# EAGLE design Shield_Eth06-REV3 (EAGLE 6.4)
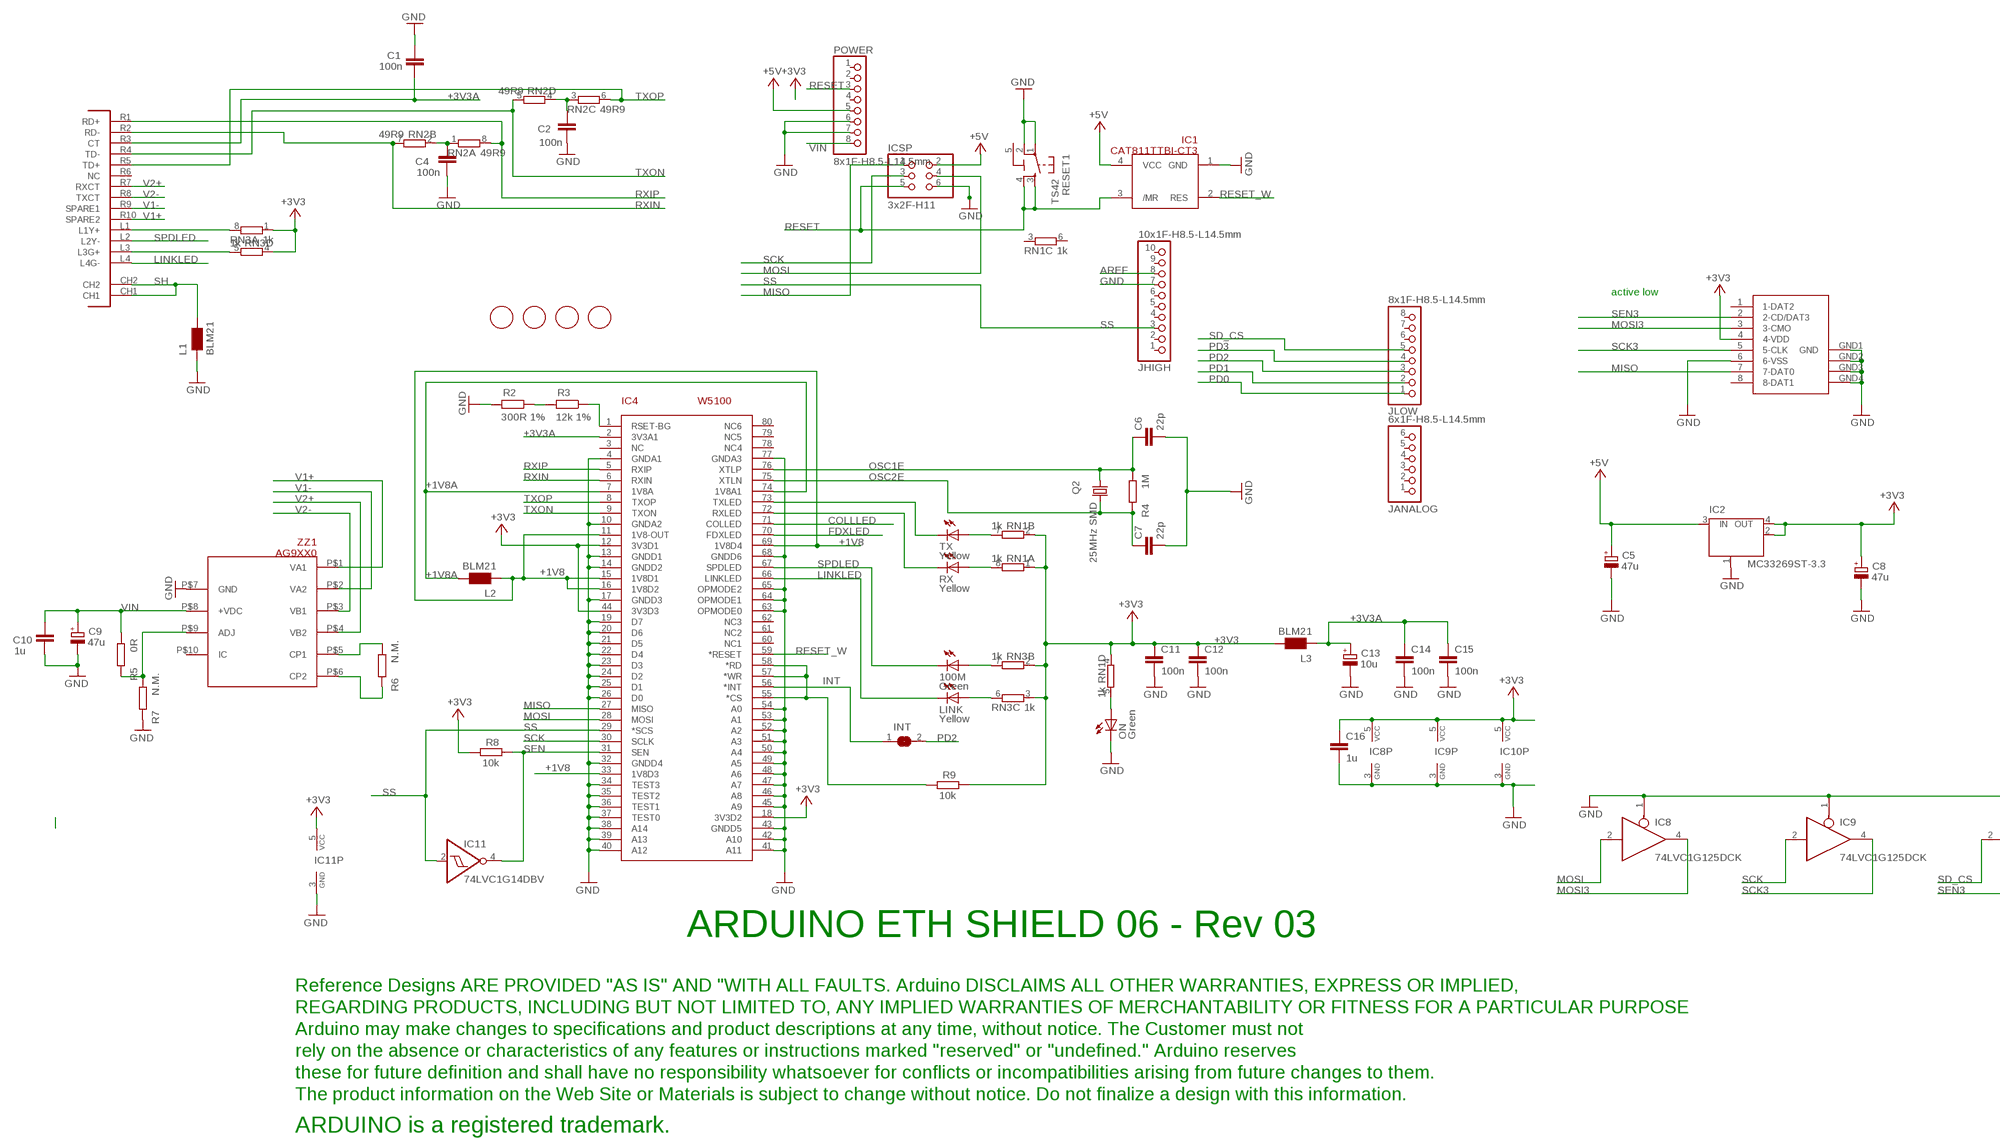
[diagram p0: schematic, sheet 1, part 1 of 2]
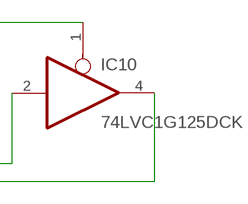
[diagram p1: schematic, sheet 1, part 2 of 2]

## Parts
100M  Green  LEDCHIPLED_0805  [CHIPLED_0805]
C1  100n  C-EUC0603  [C0603-ROUND]
C2  100n  C-EUC0603  [C0603-ROUND]
C4  100n  C-EUC0603  [C0603-ROUND]
C5  47u  CPOL-EUD  [PANASONIC_D]
C6  22p  C-EUC0603  [C0603-ROUND]
C7  22p  C-EUC0603  [C0603-ROUND]
C8  47u  CPOL-EUD  [PANASONIC_D]
C9  47u  CPOL-EUD  [PANASONIC_D]
C10  1u  C-EUC0603  [C0603-ROUND]
C11  100n  C-EUC0603  [C0603-ROUND]
C12  100n  C-EUC0603  [C0603-ROUND]
C13  10u  CPOL-EUSMCB  [SMC_B]
C14  100n  C-EUC0603  [C0603-ROUND]
C15  100n  C-EUC0603  [C0603-ROUND]
C16  1u  C-EUC0603  [C0603-ROUND]
FID1  FIDUCIALMOUNT  [FIDUCIA-MOUNT]
FID2  FIDUCIALMOUNT  [FIDUCIA-MOUNT]
FID3  FIDUCIALMOUNT  [FIDUCIA-MOUNT]
FID4  FIDUCIALMOUNT  [FIDUCIA-MOUNT]
IC1  CAT811TTBI-CT3  STM812  [SOT143]
IC2  MC33269ST-3.3  MC33269ST-3.3T3  [SOT223]
IC4  W5100  [SQFP-S-10X10-80]
IC8  74LVC1G125DCK  [SC70-5]
IC9  74LVC1G125DCK  [SC70-5]
IC10  74LVC1G125DCK  [SC70-5]
IC11  74LVC1G14DBV  [SOT23-5]
ICSP  3x2F-H11  PINHD-2X3  [2X03]
INT  SJ  [SJ]
JANALOG  6x1F-H8.5-L14.5mm  PINHD-1X6  [1X06]
JHIGH  10x1F-H8.5-L14.5mm  PINHD-1X10  [1X10]
JLOW  8x1F-H8.5-L14.5mm  PINHD-1X8  [1X08]
L1  BLM21  WE-CBF_0805  [0805]
L2  BLM21  WE-CBF_0805  [0805]
L3  BLM21  WE-CBF_0805  [0805]
LINK  Yellow  LEDCHIPLED_0805  [CHIPLED_0805]
ON  Green  LEDCHIPLED_0805  [CHIPLED_0805]
POWER  8x1F-H8.5-L14.5mm  PINHD-1X8  [1X08]
Q2  25MHz SMD  CRYSTALHC49UP  [HC49UP]
R2  300R 1%  R-EU_0603-RND  [R0603-ROUND]
R3  12k 1%  R-EU_0603-RND  [R0603-ROUND]
R4  1M  R-EU_0603-RND  [R0603-ROUND]
R5  0R  R-EU_0603-RND  [R0603-ROUND]
R6  N.M.  R-EU_0603-RND  [R0603-ROUND]
R7  N.M.  R-EU_0603-RND  [R0603-ROUND]
R8  10k  R-EU_0603-RND  [R0603-ROUND]
R9  10k  R-EU_R0603  [R0603-ROUND]
RESET1  TS42  [TS42]
RN1  1k  4R-NCAY16  [CAY16]
RN2  49R9  4R-NCAY16  [CAY16]
RN3  1k  4R-NCAY16  [CAY16]
RX  Yellow  LEDCHIPLED_0805  [CHIPLED_0805]
TX  Yellow  LEDCHIPLED_0805  [CHIPLED_0805]
U$1  POE-RJ45  [POE-RJ45]
U$2  DISCLAIMER  [DISCLAIMER]
X1  SDCARD-15TW-8821  [SDCARD-15TW-8821]
ZZ1  AG9XX0  [AG9000]

## Nets
+1V8 [power]: IC4.11(1V8-OUT) IC4.15(1V8D1) IC4.16(1V8D2) IC4.33(1V8D3) IC4.69(1V8D4) L2.1
+1V8A [power]: IC4.7(1V8A) IC4.74(1V8A1) L2.2
+3V3 [power]: C8.+ C11.1 C12.1 C16.1 IC2.2(OUT) IC2.4(OUT) IC4.12(3V3D1) IC4.18(3V3D2) IC4.44(3V3D3) IC8.5(VCC) IC9.5(VCC) IC10.5(VCC) IC11.5(VCC) L3.2 R8.1 R9.2 RN1.1 RN1.2 RN1.4 RN3.1 RN3.2 RN3.3 RN3.4 X1.4(4-VDD)
+3V3A [power]: C1.1 C13.+ C14.1 C15.1 IC4.2(3V3A1) L3.1 U$1.R3(CT)
+5V [power]: C5.+ IC1.4(VCC) IC2.3(IN) ICSP.2 POWER.5
AREF: JHIGH.8
COLLLED: IC4.71(COLLED)
FDXLED: IC4.70(FDXLED)
GND [power]: C1.2 C2.1 C4.1 C5.- C6.2 C7.2 C8.- C9.- C10.1 C11.2 C12.2 C13.- C14.2 C15.2 C16.2 IC1.1(GND) IC2.1(GND/ADJ) IC4.4(GNDA1) IC4.10(GNDA2) IC4.13(GNDD1) IC4.14(GNDD2) IC4.17(GNDD3) IC4.19(D7) IC4.20(D6) IC4.21(D5) IC4.22(D4) IC4.23(D3) IC4.24(D2) IC4.25(D1) IC4.26(D0) IC4.32(GNDD4) IC4.34(TEST3) IC4.35(TEST2) IC4.36(TEST1) IC4.37(TEST0) IC4.38(A14) IC4.39(A13) IC4.40(A12) IC4.41(A11) IC4.42(A10) IC4.43(GNDD5) IC4.45(A9) IC4.46(A8) IC4.47(A7) IC4.48(A6) IC4.49(A5) IC4.50(A4) IC4.51(A3) IC4.52(A2) IC4.53(A1) IC4.54(A0) IC4.63(OPMODE0) IC4.64(OPMODE1) IC4.65(OPMODE2) IC4.68(GNDD6) IC4.77(GNDA3) IC8.1(OE) IC8.3(GND) IC9.1(OE) IC9.3(GND) IC10.1(OE) IC10.3(GND) IC11.3(GND) ICSP.6 JHIGH.7 L1.1 ON.C POWER.6 POWER.7 R2.2 R7.2 RESET1.1 RESET1.2 X1.6(6-VSS) X1.GND1(GND) X1.GND2(GND1) X1.GND3(GND2) X1.GND4(GND3) ZZ1.P$7(GND)
INT: IC4.56(*INT) INT.1
LINKLED: IC4.66(LINKLED) LINK.C U$1.L4(L4G-)
MISO: IC4.27(MISO) ICSP.1 X1.7(7-DAT0)
MOSI: IC4.28(MOSI) IC8.2(I) ICSP.4
MOSI3: IC8.4(O) X1.3(3-CMO)
N$2: RN3.5 U$1.L3(L3G+)
N$3: RN3.8 U$1.L1(L1Y+)
N$6: IC4.73(TXLED) TX.C
N$7: IC4.72(RXLED) RX.C
N$8: ON.A RN1.5
N$9: RN1.7 TX.A
N$10: C2.2 RN2.3 RN2.4
N$22: RN1.8 RX.A
N$25: 100M.A RN3.7
N$26: LINK.A RN3.6
N$29: C4.2 RN2.1 RN2.2
N$30: R2.1 R3.2
N$31: IC4.1(RSET-BG) R3.1
N$32: R6.1 ZZ1.P$5(CP1)
N$33: R6.2 ZZ1.P$6(CP2)
N$34: R5.2 R7.1 ZZ1.P$9(ADJ)
N$36: IC4.55(*CS) IC4.57(*WR) IC4.58(*RD) R9.1
OSC1E: C6.1 IC4.76(XTLP) Q2.1 R4.1
OSC2E: C7.1 IC4.75(XTLN) Q2.2 R4.2
PD0: JLOW.1
PD1: JLOW.2
PD2: INT.2 JLOW.3
PD3: JLOW.4
RESET: IC1.3(/MR) ICSP.5 POWER.3 RESET1.3 RESET1.4
RESET_W: IC1.2(RES) IC4.59(*RESET)
RXIN: IC4.6(RXIN) RN2.7 U$1.R2(RD-)
RXIP: IC4.5(RXIP) RN2.8 U$1.R1(RD+)
SCK: IC4.30(SCLK) IC9.2(I) ICSP.3
SCK3: IC9.4(O) X1.5(5-CLK)
SD_CS: IC10.2(I) JLOW.5
SEN: IC4.31(SEN) IC11.4(O) R8.2
SEN3: IC10.4(O) X1.2(2-CD/DAT3)
SH: L1.2 U$1.CH1 U$1.CH2
SPDLED: 100M.C IC4.67(SPDLED) U$1.L2(L2Y-)
SS: IC4.29(*SCS) IC11.2(I) JHIGH.3
TXON: IC4.9(TXON) RN2.5 U$1.R4(TD-)
TXOP: IC4.8(TXOP) RN2.6 U$1.R5(TD+)
V1+ [VIN]: U$1.R10(SPARE2) ZZ1.P$1(VA1)
V1- [VIN]: U$1.R9(SPARE1) ZZ1.P$2(VA2)
V2+ [VIN]: U$1.R7(RXCT) ZZ1.P$4(VB2)
V2- [VIN]: U$1.R8(TXCT) ZZ1.P$3(VB1)
VIN [VIN]: C9.+ C10.2 POWER.8 R5.1 ZZ1.P$8(+VDC)
Unconnected: IC4.3(NC) IC4.60(NC1) IC4.61(NC2) IC4.62(NC3) IC4.78(NC4) IC4.79(NC5) IC4.80(NC6) JANALOG.1 JANALOG.2 JANALOG.3 JANALOG.4 JANALOG.5 JANALOG.6 JHIGH.1 JHIGH.2 JHIGH.4 JHIGH.5 JHIGH.6 JHIGH.9 JHIGH.10 JLOW.6 JLOW.7 JLOW.8 POWER.1 POWER.2 POWER.4 RN1.3 RN1.6 U$1.R6(NC) X1.1(1-DAT2) X1.8(8-DAT1) ZZ1.P$10(IC)

## Notes on the sheet
- active low
- ARDUINO ETH SHIELD 06 - Rev 03

## Power pins joined to a net without a drawn wire
5-GND: RESET1.5(5-GND)

## Library data of the parts
100M LINK ON RX TX = led:LED: LED OSRAM: - CHIPLED LG R971, LG N971, LY N971, LG Q971, LY Q971, LO R971, LY R971 LH N974, LH R974 LS Q976, LO Q976, LY Q976 LO Q996 - Hyper CHIPLED LW Q18S LB Q993, LB Q99A, LB R99A - SideLED LS A670, LO A670, LY A670, LG A670, LP A670 LB A673, LV A673, LT A673, LW A673 LH A674 LY A675 LS A676, LA A676, LO A676, LY A676, LW A676 LS A679, LY A679, LG A679 - Hyper Micro SIDELED® LS Y876, LA Y876, LO Y876, LY Y876 LT Y87S - SmartLED LW L88C, LW L88S LB L89C, LB L89S, LG L890 LS L89K, LO L89K, LY L89K LS L896, LA L896, LO L896, LY L896 - TOPLED LS T670, LO T670, LY T670, LG T670, LP T670 LSG T670, LSP T670, LSY T670, LOP T670, LYG T670 LG T671, LOG T671, LSG T671 LB T673, LV T673, LT T673, LW T673 LH T674 LS T676, LA T676, LO T676, LY T676, LB T676, LH T676, LSB T676, LW T676 LB T67C, LV T67C, LT T67C, LS T67K, LO T67K, LY T67K, LW E67C LS E67B, LA E67B, LO E67B, LY E67B, LB E67C, LV E67C, LT E67C LW T67C LS T679, LY T679, LG T679 LS T770, LO T770, LY T770, LG T770, LP T770 LB T773, LV T773, LT T773, LW T773 LH T774 LS E675, LA E675, LY E675, LS T675 LS T776, LA T776, LO T776, LY T776, LB T776 LHGB T686 LT T68C, LB T68C - Hyper Mini TOPLED® LB M676 - Mini TOPLED Santana® LG M470 LS M47K, LO M47K, LY M47K Source: http://www.osram.convergy.de LUXEON: - LUMILED® LXK2-PW12-R00, LXK2-PW12-S00, LXK2-PW14-U00, LXK2-PW14-V00 LXK2-PM12-R00, LXK2-PM12-S00, LXK2-PM14-U00 LXK2-PE12-Q00, LXK2-PE12-R00, LXK2-PE12-S00, LXK2-PE14-T00, LXK2-PE14-U00 LXK2-PB12-K00, LXK2-PB12-L00, LXK2-PB12-M00, LXK2-PB14-N00, LXK2-PB14-P00, LXK2-PB14-Q00 LXK2-PR12-L00, LXK2-PR12-M00, LXK2-PR14-Q00, LXK2-PR14-R00 LXK2-PD12-Q00, LXK2-PD12-R00, LXK2-PD12-S00 LXK2-PH12-R00, LXK2-PH12-S00 LXK2-PL12-P00, LXK2-PL12-Q00, LXK2-PL12-R00 Source: www.luxeon.com KINGBRIGHT: KA-3528ASYC Source: www.kingbright.com
C1 C2 C4 C6 C7 C10-C12 C14-C16 = SmartPrj:C-EU: CAPACITOR, European symbol
C5 C8 C9 C13 = rcl:CPOL-EU: POLARIZED CAPACITOR, European symbol
FID1-FID4 = SmartPrj:FIDUCIALMOUNT
IC1 = SmartPrj:STM812
IC2 = linear:MC33269ST*: Adjustable Output Low Dropout Voltage Regulator 800 mA Source: http://www.onsemi.com/pub/Collateral/MC33269-D.PDF
IC4 = SmartPrj:W5100
IC8-IC10 = 74xx-little-us:74*1G125: Single Bus Buffer Gate with 3-State Output
IC11 = 74xx-little-de:74*1G14: Single Schmitt-Trigger Inverter Gate
ICSP = SmartPrj:PINHD-2X3: PIN HEADER
INT = jumper:SJ: SMD solder JUMPER
JANALOG = pinhead:PINHD-1X6: PIN HEADER
JHIGH = SmartPrj:PINHD-1X10: PIN HEADER
JLOW POWER = SmartPrj:PINHD-1X8: PIN HEADER
L1-L3 = wuerth-elektronik:WE-CBF: SMD EMI Suppression Ferrite Beads - excellent anti-EMI properties - low DCR - impedances till 3000 ohms - rated current up to 6 A
Q2 = crystal:CRYSTAL: CRYSTAL
R2-R9 = SmartPrj:R-EU_: RESISTOR, European symbol
RESET1 = SmartPrj:TS42: TS42 Dongnan Electronics Tact switch VDC 12V - 50mA
RN1-RN3 = resistor-dil:4R-N: Array Chip Resistor Source: RS Component / Phycomp
U$1 = SmartPrj:POE-RJ45
U$2 = SmartPrj:DISCLAIMER
X1 = st-mod v1.3:SDCARD-15TW-8821: SD Card SDCARD 15TW 8821
ZZ1 = SmartPrj:AG9XX0: PoE module

## Net classes
0 default: width 0.152 mm, drill 0.61 mm, clearance 0.152 mm
1 power: width 0.152 mm, drill 0.61 mm, clearance 0.152 mm
2 VIN: width 0.305 mm, drill 0.61 mm, clearance 0.152 mm

## Board
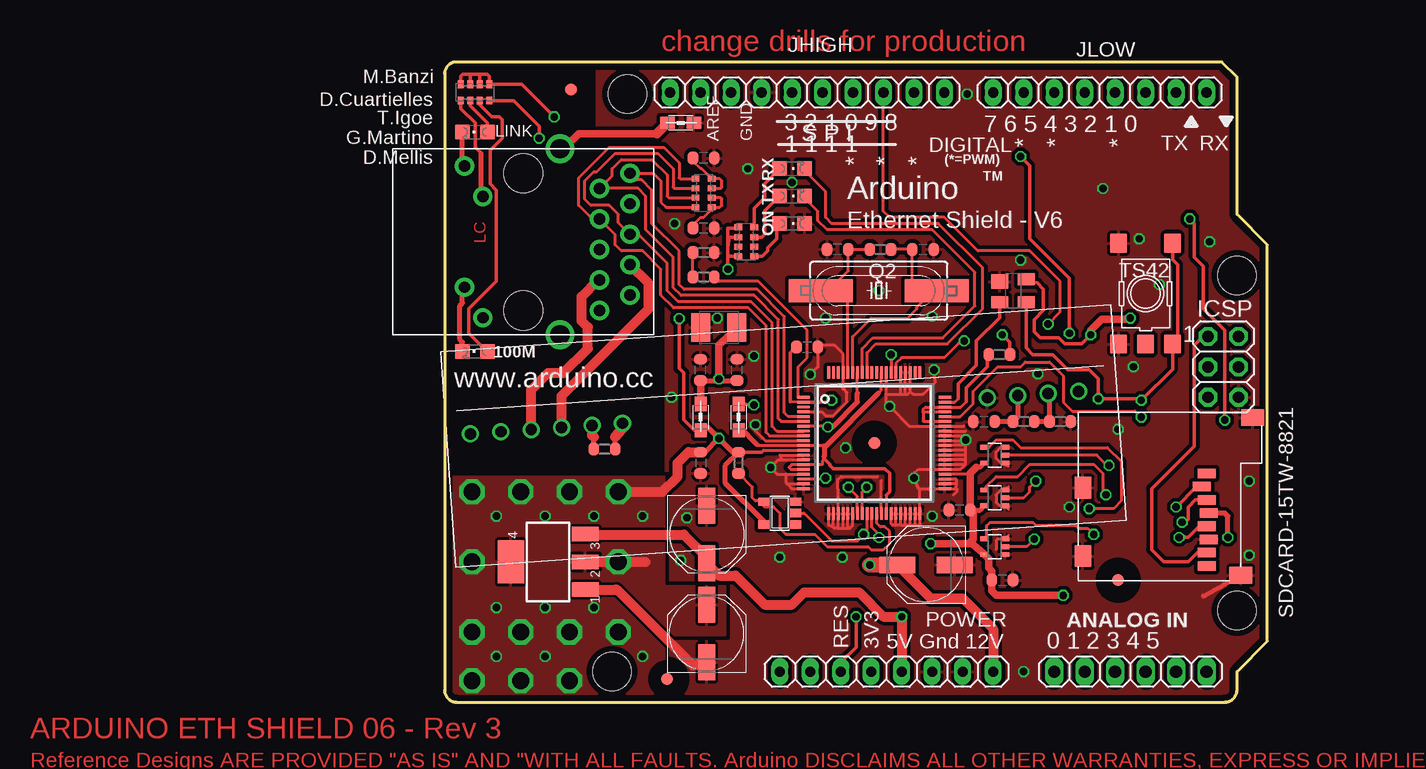
[diagram p2: board, top side]
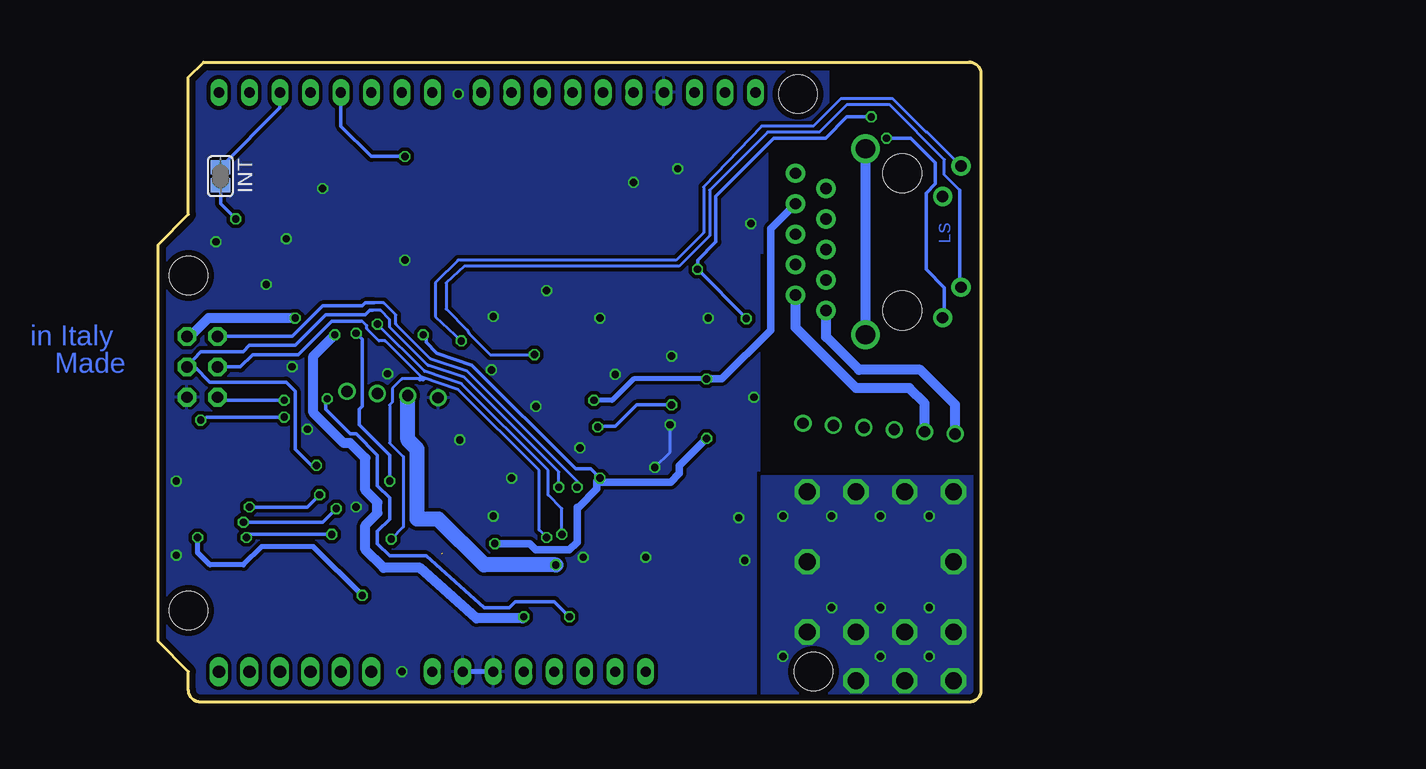
[diagram p3: board, bottom side, seen from below]

Size 68.58 x 53.34 mm. Coordinates in mm from the lower left corner, seen from the top.
Outline: 66.04,2.54 68.58,5.08 68.58,38.1 66.04,40.64 66.04,52.07 64.77,53.34 1,53.34 arc90 0,52.34 0,1 arc90 1,0 65.04,0 arc90 66.04,1 66.04,2.54
Copper layers (1*16): Top 0.035mm / dielectric 1.5mm / Bottom 0.035mm
Design rules "default": minimum track width 10mil, minimum drill 10mil, track to track 8mil, track to pad 8mil, pad to pad 8mil, via to via 8mil, smd to smd 6mil, copper to edge 20mil, drill to drill 10mil, minimum pad ring 6mil, minimum via ring 6mil, stop-mask expansion 2mil, vias tented up to drill 0mil, thermal gap 10mil
Holes 3.2 mm at 66.04,35.56 66.04,7.62 15.24,50.67 13.97,2.54

### Footprints (pad centres in the part's own frame; a part is rotated, then mirrored left to right if it is on the bottom)
CHIPLED_0805 = smd 1.2 x 1.2: A 0,-1.05; C 0,1.05
C0603-ROUND = smd 0.898 x 1.1: 1 -0.889,0; 2 0.889,0
PANASONIC_D = smd 3 x 1.4: + 2.4,0; - -2.4,0
SMC_B = smd 1.6 x 2.4: + -1.5,0; - 1.5,0
FIDUCIA-MOUNT = smd 1.016 x 1.016: P$1 0,0
SOT143 = smd 1.2 x 1.44: 1 -0.75,-1.1 | smd 1 x 1.44: 2 0.95,-1.1; 3 0.95,1.1; 4 -0.95,1.1
SOT223 = smd 1.219 x 2.235: 1 -2.311,-3.099; 2 0,-3.099; 3 2.311,-3.099 | smd 3.6 x 2.2: 4 0,3.099
SQFP-S-10X10-80 = smd 0.241 x 1.041: 1 -3.8,-5.879; 2 -3.4,-5.879; 3 -3,-5.879; 4 -2.6,-5.879; 5 -2.2,-5.879; 6 -1.8,-5.879; 7 -1.4,-5.879; 8 -1,-5.879; 9 -0.6,-5.879; 10 -0.2,-5.879; 11 0.2,-5.879; 12 0.6,-5.879; 13 1,-5.879; 14 1.4,-5.879; 15 1.8,-5.879; 16 2.2,-5.879; 17 2.6,-5.879; 18 3,-5.879; 19 3.4,-5.879; 20 3.8,-5.879; 41 3.8,5.879; 42 3.4,5.879; 43 3,5.879; 44 2.6,5.879; 45 2.2,5.879; 46 1.8,5.879; 47 1.4,5.879; 48 1,5.879; 49 0.6,5.879; 50 0.2,5.879; 51 -0.2,5.879; 52 -0.6,5.879; 53 -1,5.879; 54 -1.4,5.879; 55 -1.8,5.879; 56 -2.2,5.879; 57 -2.6,5.879; 58 -3,5.879; 59 -3.4,5.879; 60 -3.8,5.879 | smd 1.041 x 0.241: 21 5.879,-3.8; 22 5.879,-3.4; 23 5.879,-3; 24 5.879,-2.6; 25 5.879,-2.2; 26 5.879,-1.8; 27 5.879,-1.4; 28 5.879,-1; 29 5.879,-0.6; 30 5.879,-0.2; 31 5.879,0.2; 32 5.879,0.6; 33 5.879,1; 34 5.879,1.4; 35 5.879,1.8; 36 5.879,2.2; 37 5.879,2.6; 38 5.879,3; 39 5.879,3.4; 40 5.879,3.8; 61 -5.879,3.8; 62 -5.879,3.4; 63 -5.879,3; 64 -5.879,2.6; 65 -5.879,2.2; 66 -5.879,1.8; 67 -5.879,1.4; 68 -5.879,1; 69 -5.879,0.6; 70 -5.879,0.2; 71 -5.879,-0.2; 72 -5.879,-0.6; 73 -5.879,-1; 74 -5.879,-1.4; 75 -5.879,-1.8; 76 -5.879,-2.2; 77 -5.879,-2.6; 78 -5.879,-3; 79 -5.879,-3.4; 80 -5.879,-3.8
SC70-5 = smd 0.4 x 0.7: 1 -0.65,-0.85; 2 0,-0.85; 3 0.65,-0.85; 4 0.65,0.85; 5 -0.65,0.85
SOT23-5 = smd 0.69 x 0.99: 1 -0.95,-1.29; 2 0,-1.29; 3 0.95,-1.29; 4 0.95,1.3; 5 -0.95,1.3
2X03 = drill 0.95 pad 1.55 octagon: 1 -2.54,-1.27; 2 -2.54,1.27; 3 0,-1.27; 4 0,1.27; 5 2.54,-1.27; 6 2.54,1.27
SJ = smd 1.168 x 1.6: 1 -0.762,0; 2 0.762,0
1X06 = drill 1.016 long: 1 -6.35,0; 2 -3.81,0; 3 -1.27,0; 4 1.27,0; 5 3.81,0; 6 6.35,0
1X10 = drill 0.85 pad 1.422 long: 1 -11.43,0; 2 -8.89,0; 3 -6.35,0; 4 -3.81,0; 5 -1.27,0; 6 1.27,0; 7 3.81,0; 8 6.35,0; 9 8.89,0; 10 11.43,0
1X08 = drill 0.85 pad 1.422 long: 1 -8.89,0; 2 -6.35,0; 3 -3.81,0; 4 -1.27,0; 5 1.27,0; 6 3.81,0; 7 6.35,0; 8 8.89,0
0805 = smd 1.2 x 1: 1 -1.1,0; 2 1.1,0
HC49UP = smd 5.334 x 1.93: 1 -4.826,0; 2 4.826,0
R0603-ROUND = smd 0.898 x 1.1: 1 -0.889,0; 2 0.889,0
TS42 = smd 1.6 x 1.4: 1 -4.2,2.25; 2 4.2,2.25; 3 -4.2,-2.25; 4 4.2,-2.25; 5 -4.2,0
CAY16 = smd 0.5 x 0.65: 1 -1.2,-0.675; 2 -0.4,-0.675; 3 0.4,-0.675; 4 1.2,-0.675; 5 1.2,0.675; 6 0.4,0.675; 7 -0.4,0.675; 8 -1.2,0.675
POE-RJ45 = drill 1.6: CH1 13.94,7.75; CH2 13.94,-7.75 | drill 0.95 pad 1.6: L1 7.51,-6.325; L2 5.99,-3.785; L3 7.51,3.785; L4 5.99,6.325; R1 19.77,5.715; R2 17.23,4.445; R3 19.77,3.175; R4 17.23,1.905; R5 19.77,0.635; R6 17.23,-0.635; R7 19.77,-1.905; R8 17.23,-3.175; R9 19.77,-4.445; R10 17.23,-5.715 | hole 3.25: 10.89,5.715; 10.89,-5.715
SDCARD-15TW-8821 = smd 0.8 x 1.5: 1 0,0; 2 1.1,-0.4; 3 2.2,0; 4 3.3,0.2; 5 4.4,0; 6 5.5,0.2; 7 6.6,0; 8 7.7,0 | smd 1.4 x 1.9: GND1 -4.66,3.85; GND2 8.49,2.85 | smd 1.8 x 1.4: GND3 1.19,-10.3; GND4 6.89,-10.3
AG9000 = drill 0.95 pad 1.422: P$1 0,0; P$2 2.54,0; P$3 5.08,0; P$4 7.62,0; P$5 10.16,0; P$6 12.7,0; P$7 43.18,0; P$8 45.72,0; P$9 48.26,0; P$10 50.8,0

### Placement (x,y rotation side)
100M  2.54,29.21 90 top
C1  30.23,29.59 0 top
C2  21.59,45.34 180 top
C4  21.59,39.5 180 top
C5  21.84,13.97 270 top
C6  32.77,37.72 180 top
C7  39.88,37.72 0 top
C8  21.84,5.71 90 top
C9  40.13,11.43 180 top
C10  44.96,23.37 0 top
C11  42.93,16 180 top
C12  21.34,19.94 270 top
C13  22.86,31.22 180 top
C14  21.34,27.69 90 top
C15  24.38,27.69 90 top
C16  46.48,10.16 0 top
FID1  10.54,51.05 0 top
FID2  56.13,10.16 0 top
FID3  35.81,21.59 0 top
FID4  18.54,1.91 0 top
IC1  47.37,34.29 270 top
IC2  8.64,11.68 90 top
IC4  35.81,21.59 270 top
IC8  45.85,20.57 90 top
IC9  45.85,12.95 90 top
IC10  45.85,17.02 90 top
IC11  27.94,15.75 90 top
ICSP  64.9,27.94 270 top
INT  63.37,43.81 90 bottom
JANALOG  57.15,2.54 0 top
JHIGH  30.23,50.8 180 top
JLOW  54.61,50.8 180 top
L1  19.68,48.26 180 top
L2  24.51,23.75 90 top
L3  21.34,23.75 270 top
LINK  2.54,47.5 90 top
ON  28.96,39.88 270 top
POWER  36.83,2.54 0 top
Q2  36.2,34.29 0 top
R2  21.59,37.47 0 top
R3  21.59,35.43 180 top
R4  36.32,37.72 0 top
R5  48.26,23.37 0 top
R6  13.34,21.08 0 top
R7  51.31,23.37 0 top
R8  24.51,19.94 270 top
R9  46.23,28.96 0 top
RESET1  58.42,34.04 90 top
RN1  25.15,38.35 270 top
RN2  21.59,42.42 90 top
RN3  2.54,50.8 180 top
RX  28.96,44.45 270 top
TX  28.96,42.16 270 top
U$1  -4.32,38.35 0 top
U$2  -34.54,-23.62 0 top  (outside the outline)
X1  63.5,19.05 270 top
ZZ1  2.16,22.35 4 top

### Tracks (layer width: path | path; a pad name or v marks a point on that pad's centre or on a via)
+1V8
  Top 0.254: 31.62,20.45 31.59,20.3 31.5,20.07 31.5,19.79 IC4.15 28.93,19.79 28.7,19.56 28.87,19.39 IC4.16 | 36.81,17.26 IC4.33 | 26.04,21.46 26.11,21.39 IC4.11 31.7,21.39 31.75,21.34 | IC4.69 36.41,26 36.16,25.75
  Top 0.305: 31.59,20.3 32.08,19.81 32.08,19.73 32.38,19.43 36.7,19.43 37.08,19.05 37.08,17.53 36.81,17.26
  Top 0.406: 31.62,20.45 31.62,21.34 31.75,21.34 36.16,25.75 | 26.04,21.46 24.64,22.86 24.55,22.86 L2.1
+1V8A  (via drill 0.61)
  Top 0.254: IC4.7 31.62,22.99 31.88,22.99 | 34.41,25.74 IC4.74
  Top 0.305: L2.2 v25.78,24.77
  Top 0.406: 31.88,22.99 v31.94,22.92 32.35,22.92 34.41,24.99 34.41,25.74
  Bottom 0.305: v25.78,24.77 28.7,24.77 30.48,22.99 31.37,22.99 v31.94,22.92
+3V3  (via drill 0.61, 1.4)  (1 unrouted)
  Top 0.254: IC4.18 31.57,18.59 v31.75,18.67 | IC4.12 26.58,20.99 26.42,20.83 | IC4.44 43.63,18.99 43.81,19.05 | 44.18,14.34 44.18,14.37 44.13,14.41 | IC8.5 45,19.81
  Top 0.305: RN3.4 1.34,52.14 1.52,52.32 2.03,52.32 | 3.05,52.32 2.03,52.32 | 3.05,52.32 3.56,52.32 3.74,52.14 RN3.1 6.44,51.48 v9.14,48.77 | RN3.3 2.14,52.22 2.03,52.32 | RN3.2 2.94,52.22 3.05,52.32 | R8.1 26.42,20.83 | v19.56,31.95 19.56,27.81 19.94,27.43 19.94,23.55 20.83,22.66 L3.2 | v46.48,30.61 47.12,29.97 R9.2 | 44.07,14.22 44.18,14.34 | 44.32,19.56 44.39,19.62 | C11.1 43.88,16.07 | v23.62,36.07 23.62,37.34 | 23.62,37.34 23.62,37.85 | 23.62,37.85 23.62,39.5 24.36,39.5 RN1.1 | RN1.2 23.73,38.72 23.62,37.85 | RN1.4 23.81,37.15 23.62,37.34
  Top 0.406: L3.2 21.93,22.9 v22.86,21.97 | C12.1 21.72,20.83 v22.86,21.97 | v22.86,21.97 24,20.83 R8.1 23.37,19.68 23.37,18.29 26.64,15.02 IC11.5 | C11.1 44.07,16 44.63,16 IC10.5 | X1.4 65.02,15.75 65.28,15.49 v65.28,13.72 | IC9.5 45,12.19 | 44.39,19.62 44.7,19.62 IC8.5
  Top 0.61: v51.56,8.89 45.97,8.89 45.59,9.27 C16.1 45.59,10.92 45.34,11.18 45.34,11.96 IC9.5 | 44.32,19.56 43.81,19.05 C11.1 | v40.51,13.21 43.69,13.21 43.81,13.34 | 44.07,16 44.07,14.22 44.07,13.59 43.81,13.34 | 43.81,13.34 44.6,12.64 44.89,12.38
  Top 0.813: IC2.2 16.75,11.68 | 5.59,12.19 5.59,11.73 IC2.4 | C12.1 20.32,20.83 19.43,19.94 19.43,18.8 18.16,17.53 v14.48,17.53
  Bottom 0.305: v31.75,18.67 32.51,19.43 33.78,19.43 42.42,28.07 45.34,29.08 46.23,29.97 46.23,30.35 v46.48,30.61 46.48,30.35 | v9.14,48.77 11.18,48.77 12.95,46.99 17.27,46.99 22.1,42.16 22.1,38.35 23.62,36.83 v23.62,36.07 19.56,32 v19.56,31.95
  Bottom 0.406: v65.28,13.72 65.28,12.45 64.26,11.43 61.47,11.43 59.94,12.95 55.63,12.95 v51.56,8.89
  Bottom 0.61: v22.86,21.97 25.15,19.68 25.15,19.05 25.86,18.34 31.67,18.34 v31.75,18.67 32,18.41 32,17.78 33.53,16.26 33.66,16.26 33.66,13.34 34.29,12.7 37.08,12.7 37.59,13.21 v40.51,13.21
  other vias: 2.29,17.53 6.35,17.53 10.41,17.53 4.32,15.49 8.38,15.49 12.45,15.49 16.51,15.49 4.32,7.87 8.38,7.87 12.45,7.87 6.35,5.84 10.41,5.84 14.48,5.84 4.32,3.81 8.38,3.81 16.51,3.81 2.29,5.84 6.35,1.78 10.41,1.78 2.29,1.78 14.48,11.68 2.29,11.68
  pour Top: 0,18.8 18.29,18.8 18.29,9.65 23.37,9.65 23.37,5.59 18.29,5.59 18.29,0.51 0.51,0.51
  pour Bottom: 0,18.8 18.29,18.8 18.29,0.51 0.51,0.51
+3V3A  (via drill 0.61)
  Top 0.254: 28.8,25.02 31.4,24.99 IC4.2 32.5,24.99 32.16,24.99 32.18,25.02
  Top 0.305: 28.8,25.02 28.8,29.11 C1.1
  Top 0.406: v32.26,25.15 32.18,25.02 | C15.1 23.11,26.8 v22.86,26.92 22.61,26.8 C14.1
  Top 0.61: L3.1 C14.1 | C13.+ 23.75,30.61 22.86,29.72 v22.86,26.92
  Bottom 0.406: v32.26,25.15 30.73,25.15 28.96,26.92 v22.86,26.92
  Bottom 0.61: v22.86,26.92 21.59,26.92 17.53,30.99 17.53,39.45 U$1.R3
+5V  (via drill 0.61)
  Top 0.305: IC1.4 48.07,34.99 49.4,34.92 49.91,34.42 49.91,32.64 49.15,31.88 49.15,30.86 49.66,30.35 51.18,30.35 51.69,29.84 53.09,29.84 v53.85,30.61
  Top 0.406: v53.85,30.61 54.1,30.61
  Top 0.61: v57.15,32 57.05,31.91 54.77,31.91 53.85,30.99 v53.85,30.61
  Top 0.813: POWER.5 v38.1,7.11 36.58,7.11 34.54,9.14 29.97,9.14 28.94,8.12 26.68,8.12 24.26,10.54 22.87,10.54 C5.+ 21.84,12.06 19.94,13.96 11.77,13.96 IC2.3
  Bottom 0.813: v57.15,32 64.39,32 65.91,30.48 ICSP.2 | v53.85,30.61 55.63,28.83 55.63,24.13 53.09,21.59 52.58,21.59 51.31,20.32 51.31,17.65 50.29,16.64 50.29,15.75 51.31,14.73 51.31,12.7 49.78,11.18 46.74,11.18 42.04,6.99 38.23,6.99 v38.1,7.11
AREF
  Bottom 0.305: JHIGH.8 23.88,51.18 24,51.31 24,50.93 JHIGH.8
GND  (via drill 0.61)
  Top 0.254: IC4.4 31.44,24.19 31.75,23.88 32.41,23.88 33.53,24.99 33.53,25.78 33.21,26.09 IC4.77 33.21,29.02 32.51,29.72 31.24,29.72 C1.2 31.11,27.94 v30.48,27.3 | 28.45,18.99 27.75,18.99 v27.18,19.56 27.81,20.19 28.06,20.19 | 28.45,18.99 IC4.17 | IC4.13 27.96,20.59 27.94,20.57 28.06,20.45 28.06,20.19 | 28.06,20.19 IC4.14 | 28.55,18.19 IC4.19 | 28.55,18.19 28.45,18.29 28.45,18.99 | IC4.20 28.95,17.79 28.55,18.19 | IC4.26 34.01,14.71 33.78,14.48 33.53,14.48 | 32.77,14.48 32.51,14.48 32.41,14.58 | 32.77,14.48 33.27,14.48 | 33.27,14.48 33.53,14.48 | IC4.21 32.01,14.72 32.41,14.58 | 32.41,14.58 IC4.22 | 32.77,14.48 32.81,14.53 IC4.23 32.81,17.73 32.77,17.78 32.77,18.54 33.02,18.8 36.07,18.8 | IC4.24 33.21,14.54 33.27,14.48 | IC4.25 33.61,14.56 33.53,14.48 | v39.12,18.67 39.61,17.66 IC4.40 39.62,15.98 39.62,14.73 39.12,14.73 | 37.59,14.73 37.34,14.73 37.21,14.86 IC4.34 | 38.1,14.73 37.59,14.73 | 38.1,14.73 38.35,14.73 | 38.35,14.73 38.86,14.73 | 38.86,14.73 39.12,14.73 | IC4.35 37.61,14.75 37.59,14.73 | IC4.36 38.01,14.82 38.1,14.73 | IC4.37 38.41,14.79 38.35,14.73 | IC4.38 38.81,14.78 38.86,14.73 | IC4.39 39.21,14.83 39.12,14.73 | 42.66,17.79 IC4.41 39.49,17.79 v39.12,18.67 | 42.66,17.79 42.67,17.78 42.67,17.53 42.42,17.27 | 42.66,17.79 42.67,18.29 | 42.67,18.29 42.67,18.54 42.62,18.59 IC4.43 | IC4.42 42.57,18.19 42.67,18.29 | 43.3,22.99 IC4.54 38.73,22.99 v37.08,24.64 36.81,24.91 36.81,25.65 | 43.43,20.07 43.43,19.81 43.41,19.79 | 43.41,19.79 43.01,19.39 IC4.45 39.46,19.39 39.12,19.05 v39.12,18.67 | 43.43,20.07 43.43,20.57 | 43.43,20.57 43.43,21.08 | 43.43,21.08 43.43,21.34 43.38,21.39 IC4.50 | IC4.53 43.42,22.59 43.43,22.61
  Top 0.254: IC4.52 43.34,22.19 v43.43,21.84 | IC4.51 43.38,21.79 | IC4.49 43.34,20.99 43.43,21.08 | IC4.48 43.42,20.59 43.43,20.57 | IC4.47 43.31,20.19 43.43,20.07 | 43.41,19.79 IC4.46 | 36.81,25.65 IC4.68 | 38.81,25.86 IC4.63 | 38.81,25.86 38.61,25.65 38.35,25.65 | 36.81,25.65 38.1,25.65 | 38.1,25.65 38.35,25.65 | IC4.64 38.41,25.71 38.35,25.65 | IC4.65 38.01,25.74 38.1,25.65 | v40.79,27.69 40.89,26.67 39.88,25.65 39.02,25.65 38.81,25.86 | IC4.10 26.72,21.79 25.91,22.61 v25.91,23.11 | IC4.32 36.41,18.45 | IC8.3 46.37,21.22 45.97,20.83 45.97,20.32 46.37,19.92 | 47,17.97 IC10.3 46.37,17.67 45.97,17.27 45.97,16.64 46.23,16.38 46.68,16.38 | 47,13.9 IC9.3 46.68,13.59 46.1,13.59 45.97,13.46 45.97,12.7 | IC8.1 47,19.62 | IC10.1 47,16.07 | IC9.1 46.81,12.19
  Top 0.406: 63.25,8.84 X1.GND2
  Top 0.61: IC2.1 11.77,9.4
  Top 0.813: IC2.1 14.26,9.37 14.35,9.4 20.69,3.06 C8.-
  Bottom 0.254: v25.91,23.11 25.91,20.83 v27.18,19.56
  Bottom 0.406: POWER.6 POWER.7
  other vias: 25.78,28.83 19.68,11.81 22.73,32 67.06,12.24 33.43,21.18 40.64,15.49 33.15,12.06 20.19,15.37 57.4,27.94 59.56,34.8 36.2,34.29 67.06,18.41 48.26,2.54 18.92,25.4 19.18,39.88 25.27,44.45 28.96,43.31 31.75,32 48.01,36.83 49.45,27.36 54.86,42.8 40.64,32.13 52.07,16.26 56.13,22.73 57.89,38.61 63.75,38.35 27.94,12.06 43.56,50.67
  pour Top (isolate 0.305, rank 2): 18.41,20.95 18.41,37.34 17.27,37.34 17.27,46.99 12.7,46.99 12.7,52.83 64.26,52.83 65.53,51.56 65.53,40.13 68.07,37.59 68.07,5.59 65.53,3.05 65.53,1.51 arc-90 64.53,0.51 18.29,0.51
  pour Bottom (isolate 0.305, rank 2): 17.78,46.99 12.7,46.99 12.7,52.83 64.26,52.83 65.53,51.56 65.53,40.13 68.07,37.59 68.07,5.59 65.53,3.05 65.53,1.51 arc-90 64.53,0.51 18.29,0.51 18.41,20.95 18.41,37.47 17.78,37.47
INT  (via drill 0.61)
  Top 0.254: IC4.56 42.97,23.79 44.04,24.84 44.04,25.88 46.1,27.94 48.01,27.94 48.39,28.32 50.42,28.32 51.56,27.18 51.56,24.99 52.3,24.26 57.53,24.26 v58.06,23.75
  Top 0.305: v65.02,23.5 65.02,30.99 63.25,32.77 63.25,36.32 62.48,37.08 62.48,39.88 v62.1,40.26
  Bottom 0.305: v58.06,23.75 64.52,23.75 v65.02,23.5 | INT.1 63.37,41.53 v62.1,40.26
LINKLED  (via drill 0.61)
  Top 0.254: IC4.66 37.61,28.22 38.1,28.7 41.66,28.7 42.8,29.84 v43.31,30.1
  Top 0.406: LINK.C 1.49,44.86 U$1.L4
  Bottom 0.254: v43.31,30.1 45.47,32.13 45.47,34.92 43.56,36.83 25.4,36.83 23.11,39.12 23.11,42.93 18.29,48.01 13.97,48.01 11.68,50.29 7.37,50.29 4.57,47.5 4.49,47.5 U$1.L4
MISO  (via drill 0.61)
  Top 0.254: IC4.27 34.41,17.14 v33.66,17.91
  Top 0.305: ICSP.1 63.25,30.48 62.48,29.72 62.48,21.34 58.93,17.78 58.93,12.7 59.94,11.68 61.98,11.68 62.74,12.45 X1.7
  Bottom 0.254: v33.66,17.91 33.66,18.41 42.8,27.56 45.85,28.57 48.77,31.5 48.77,32.26 49.78,33.27 50.55,33.27
  Bottom 0.305: ICSP.1 57.4,30.48 54.86,33.02 51.56,33.02 51.31,33.27 50.55,33.27
MOSI  (via drill 0.61)
  Top 0.254: v35.18,17.91 34.8,17.53 34.8,16.01 IC4.28 | v55.37,19.73 55.2,19.73 54.36,20.57 IC8.2
  Bottom 0.254: v35.18,17.91 35.18,19.18 43.05,27.05 46.1,28.07 49.28,31.24 49.28,31.88 50.04,32.64 50.67,32.64
  Bottom 0.305: v55.37,19.73 55.79,19.73 57.15,21.08 57.15,25.91 57.91,26.67 64.26,26.67 65.53,27.94 ICSP.4 65.02,29.21 61.47,29.21 60.96,29.72 57.15,29.72 54.61,32.26 51.31,32.26 50.93,32.64 50.67,32.64
MOSI3  (via drill 0.61)
  Top 0.254: v53.72,16.13 55.75,16.13 56.39,16.76 56.39,20.07 55.24,21.21 48.01,21.21 47.37,21.84 45.97,21.84 45.35,21.22 IC8.4
  Top 0.305: X1.3 62.57,16.85 61.98,16.26 61.98,15.24 v61.47,14.99
  Bottom 0.305: v61.47,14.99 54.86,14.99 v53.72,16.13
N$2
  Top 0.305: RN3.5 1.34,49.46 2.54,48.26 2.54,46.23 3.05,45.72
  Top 0.406: 3.05,45.72 3.05,42.25 U$1.L3
N$3  (via drill 0.61)
  Top 0.305: RN3.8 5.75,50.12 7.87,48.01 v7.87,46.99
  Bottom 0.305: v7.87,46.99 5.84,46.99 3.81,44.96 3.81,43.18 4.57,42.42 4.57,36.07 3.05,34.54 3.05,32.17 U$1.L1
N$6
  Top 0.254: IC4.73 34.8,27.21 34.8,29.46 35.69,30.35 41.53,30.35 44.2,33.02 44.2,35.81 40.64,39.37 31.88,39.37 31.11,40.13 31.11,40.89 30.01,42 TX.C
N$7
  Top 0.254: IC4.72 35.21,29.12 35.94,29.84 41.91,29.84 44.83,32.77 44.83,36.2 41.15,39.88 32.26,39.88 31.75,40.39 31.75,42.55 30.01,44.29 RX.C
N$8
  Top 0.305: RN1.5 26.49,37.15 26.92,37.59 26.92,37.85 27.69,38.61 27.69,39.66 ON.A
N$9
  Top 0.305: RN1.7 26.43,38.75 26.67,38.99 26.67,40.93 TX.A
N$10
  Top 0.254: RN2.3 23.01,42.82 23.11,42.93 23.11,43.43 22.93,43.62 RN2.4 21.43,44.45 21.34,44.45 20.74,45.05 C2.2
N$22
  Top 0.305: RN1.8 25.8,41.17 26.67,42.04 26.67,43.21 RX.A
N$25
  Top 0.305: RN3.7 2.94,49.77 3.94,48.77 4.57,48.77 4.83,48.51 4.83,46.99 3.81,45.97 3.81,43.18 4.32,42.67 4.32,35.05 2.03,32.77 2.03,30.73 3.56,29.21 100M.A
N$26
  Top 0.305: RN3.6 2.14,49.68 3.56,48.26 3.56,47.53 LINK.A
N$29
  Top 0.254: RN2.2 23.01,42.02 23.11,41.91 23.11,41.4 22.93,41.22 RN2.1 22.27,41.06 21.59,40.39 21.34,40.39 20.74,39.79 C4.2
N$30
  Top 0.254: R3.2 R2.1
N$31
  Top 0.254: R3.1 22.86,35.05 26.16,35.05 30.23,30.99 30.23,28.7 29.46,27.94 29.46,25.4 29.47,25.39 IC4.1
N$32
  Top 0.406: R6.1 12.45,22.1
  Top 0.813: 12.45,22.1 12.29,22.2 ZZ1.P$5
N$33
  Top 0.406: R6.2 14.22,22.1
  Top 0.813: 14.22,22.1 14.83,22.76 ZZ1.P$6
N$34
  Top 0.406: R5.2 R7.1 50.42,25.6 ZZ1.P$9
N$36
  Top 0.254: 43.46,25.04 43.01,24.59 IC4.58 40.08,24.59 39.88,24.38 39.88,24.13 | 39.9,23.39 IC4.55 | 39.88,23.62 39.9,23.39 | 39.88,24.13 39.88,23.62 | 39.88,23.62 39.88,23.41 39.9,23.39 | IC4.57 39.94,24.19 39.88,24.13
  Top 0.305: 43.46,25.04 43.46,26.19 45.21,27.94 45.21,28.32 R9.1
OSC1E
  Top 0.254: R4.1 C6.1 33.66,35.94 31.75,34.04 | IC4.76 33.61,33.36 32.94,34.04 31.75,34.04 | 31.75,34.04 Q2.1
OSC2E
  Top 0.254: IC4.75 34.01,30.46 35.56,32 38.61,32 39.37,32.77 39.37,32.89 40.39,33.91 40.51,33.91 | R4.2 C7.1 38.99,34.42 40.01,34.42 40.51,33.91 | 40.51,33.91 40.89,33.91 Q2.2
PD2
  Bottom 0.305: INT.2 58.42,49.53 JLOW.3
RESET  (via drill 0.61)
  Top 0.305: POWER.3 33.02,3.3 34.29,4.57 v34.29,7.11 | RESET1.4 60.67,36.87 61.09,36.45 61.09,30.25 RESET1.3 60.67,27.75 v58.06,25.15 57.94,25.27 v54.48,25.27 54.48,26.92 53.72,27.69 51.94,27.69 50.67,28.96 49.02,28.96 48.47,29.51 IC1.3
  Bottom 0.305: v58.06,25.15 63.37,25.15 ICSP.5 | v54.48,25.27 54.61,25.15 54.61,24.38 52.58,22.35 52.07,22.35 50.29,20.57 50.29,18.03 49.28,17.02 49.28,15.24 50.29,14.22 50.29,13.21 49.28,12.19 46.23,12.19 41.4,7.87 39.32,7.87 38.81,8.38 35.56,8.38 v34.29,7.11
RESET_W
  Top 0.254: IC4.59 42.52,24.99 42.8,25.27
  Top 0.305: 42.8,25.27 42.8,26.54 44.32,28.07 44.32,30.1 46.27,32.05 IC1.2
RXIN
  Top 0.254: RN2.7 18.69,42.02 18.54,42.16 18.54,43.94 17.27,45.21 14.73,45.21 13.97,44.45 13.97,43.86 U$1.R2 16.13,42.8 16.76,42.16 16.76,39.37 19.05,37.08 19.05,34.54 19.71,33.88 25.81,33.88 27.81,31.88 27.81,23.62 28.05,23.39 IC4.6
RXIP
  Top 0.254: RN2.8 18.47,41.22 18.03,41.66 18.03,43.43 17.4,44.07 U$1.R1 16,43.52 16.43,43.52 17.27,42.67 17.27,39.88 19.56,37.59 19.56,34.8 19.96,34.39 26.06,34.39 28.32,32.13 28.32,24.13 28.66,23.79 IC4.5
SCK  (via drill 0.61)
  Top 0.254: IC4.30 35.61,14.55 36.2,13.97 v36.2,13.72 | v49.15,13.59 48.51,12.95 IC9.2
  Bottom 0.254: v36.2,13.72 36.83,14.35 36.83,19.3 43.56,26.04 46.61,27.05 | v49.15,13.59 48.13,14.61 48.13,20.45 49.28,21.59 49.28,24.77 49.05,24.99 49.05,26.14 48.26,26.92 46.74,26.92 | 46.61,27.05 49.66,30.1 50.16,30.1 51.18,31.11 51.18,31.37 51.56,31.75 51.69,31.75 | 46.61,27.05 46.48,26.92
  Bottom 0.305: ICSP.3 61.72,27.94 60.71,28.96 56.9,28.96 54.1,31.75 51.69,31.75
  Bottom 0.406: 46.48,26.92 46.74,26.92
SCK3  (via drill 0.61)
  Top 0.254: v54.1,13.97 53.59,14.48 52.83,14.48 52.58,14.73 49.28,14.73 49.02,14.99 45.47,14.99 45.18,14.7 45.18,13.79 IC9.4 45,13.72
  Top 0.305: X1.5 62.91,14.65 61.98,13.72 v61.21,13.72
  Bottom 0.305: v54.1,13.97 60.96,13.97 v61.21,13.72
SD_CS  (via drill 0.61)
  Top 0.254: v49.28,18.41 48.77,17.91 48.77,17.53 48.26,17.02 IC10.2
  Top 0.305: v48.01,45.47 48.77,44.7 48.77,38.61 52.07,35.31 v52.07,30.73
  Bottom 0.305: v49.28,18.41 49.28,20.57 51.82,23.11 51.82,24.38 51.56,24.64 51.56,30.23 v52.07,30.73 51.82,30.48 | v48.01,45.47 50.8,45.47 53.34,48.01 JLOW.5
SEN
  Top 0.254: R8.2 25.65,17.91 25.65,17.02 25.91,16.76 26.16,16.76 26.64,16.29 | IC11.4 26.64,16.29 | 26.64,16.29 27.4,16.29 27.94,15.75 27.94,14.48 28.45,13.97 30.86,13.97 31.88,12.95 35.31,12.95 35.56,12.7 36.58,12.7 37.08,13.21 37.08,14.22 36.7,14.61 36.32,14.61 36.01,14.91 IC4.31
SEN3  (via drill 0.61)
  Top 0.254: v55.12,17.27 54.86,17.53 54.86,19.05 54.1,19.81 48.77,19.81 47.75,18.8 45.97,18.8 45.15,17.97 45.15,17.82 IC10.4 45.18,17.85
  Top 0.305: X1.2 62.65,17.95 v60.96,16.26
  Bottom 0.305: v60.96,16.26 56.13,16.26 v55.12,17.27
SH
  Top 0.61: 17.7,47.37 11.18,47.37 9.91,46.1 U$1.CH1
  Top 0.813: 17.7,47.37 L1.2
  Bottom 0.813: U$1.CH1 9.62,31.27 10.16,30.73 9.75,30.73 U$1.CH2
SPDLED  (via drill 0.61)
  Top 0.254: IC4.67 37.21,28.58 v37.21,28.96
  Top 0.406: 100M.C 1.49,30.01 1.27,30.23 1.27,33.02 1.49,33.24 1.49,34.39 U$1.L2
  Bottom 0.254: 1.78,42.67 3.05,43.94 3.05,45.21 7.62,49.78 11.18,49.78 13.46,47.5 17.78,47.5 22.61,42.67 22.61,38.86 25.15,36.32 43.05,36.32 44.58,34.92 44.58,32.77 42.8,30.99 42.67,30.73 40.89,28.96 v37.21,28.96
  Bottom 0.305: 1.78,42.67 1.78,34.67 U$1.L2
SS  (via drill 0.61)
  Top 0.254: IC11.2 29.97,15.75 32.26,13.46 34.42,13.46 v34.92,13.97 35.21,14.26 IC4.29 | v50.29,31.5 51.31,32.51 51.31,35.05 48.77,37.59 44.45,37.59 41.66,40.39 37.08,40.39 36.58,40.89 JHIGH.3
  Bottom 0.254: v34.92,13.97 34.92,16.13 36.07,17.27 36.07,19.3 43.31,26.54 46.35,27.56 v50.29,31.5
TXON
  Top 0.254: IC4.9 27.09,22.19 26.8,22.48 26.8,31.37 25.32,32.84 19.1,32.84 18.03,33.91 18.03,36.07 16.51,37.59 14.73,37.59 14.22,38.1 14.22,38.95 U$1.R4 12.32,40.26 11.18,41.4 11.18,43.69 13.72,46.23 18.29,46.23 19.56,44.96 19.56,43.69 19.63,43.62 RN2.5
TXOP
  Top 0.254: IC4.8 27.69,22.59 27.3,22.97 27.3,31.62 25.55,33.38 19.46,33.38 18.54,34.29 18.54,36.58 16.26,38.86 15.58,38.86 U$1.R5 14.48,39.96 14.48,40.64 13.72,41.4 12.19,41.4 11.68,41.91 11.68,43.43 12.45,44.2 12.7,44.2 14.22,45.72 17.78,45.72 19.05,44.45 19.05,42.93 19.16,42.82 RN2.6
V1+
  Bottom 0.813: U$1.R10 12.91,30.44 10.16,27.69 5.05,27.69 2.16,24.8 ZZ1.P$1
V1-
  Bottom 0.813: U$1.R9 15.45,31.2 10.41,26.16 5.97,26.16 4.69,24.89 ZZ1.P$2
V2+
  Top 0.813: U$1.R7 17.02,34.88 17.02,32.77 9.76,25.51 ZZ1.P$4
V2-
  Top 0.813: U$1.R8 12.83,35.18 11.43,33.78 11.43,31.75 11.94,31.24 11.94,29.46 9.91,27.43 8.64,27.43 7.23,26.02 ZZ1.P$3
VIN  (via drill 0.61)
  Top 0.406: C10.2 R5.1 47.77,23.77 ZZ1.P$8
  Top 0.813: POWER.8 45.72,6.1 43.18,8.64 40.53,8.64 C9.+
  Top 1.27: v35.43,11.43 C9.+
  Bottom 1.27: ZZ1.P$8 47.75,21.84 46.99,21.08 46.99,15.24 45.21,15.24 41.4,11.43 v35.43,11.43

### Text on the board
Top: change drills for production | LC | ARDUINO ETH SHIELD 06 - Rev 3
Bottom: LS | in Italy | Made
tPlace: S P I | DIGITAL | Ethernet Shield - V6
tNames: M.Banzi | D.Cuartielles | T.Igoe | G.Martino | 3 2 1 0 9 8 | AREF | GND | 7 6 5 4 3 2 1 0 | D.Mellis | 1 1 1 1 | * | * | * | TX | RX | * | * | * | (*=PWM) | TM | Arduino | 1 | www.arduino.cc | ANALOG IN | RES | 3V3 | 5V Gnd 12V | 0 1 2 3 4 5
Reference: C2 | C4 | R2 | R3 | C1 | R9 | C14 | C15 | C12 | R8 | C11